# EAGLE schematic main (EAGLE 8.5.0)
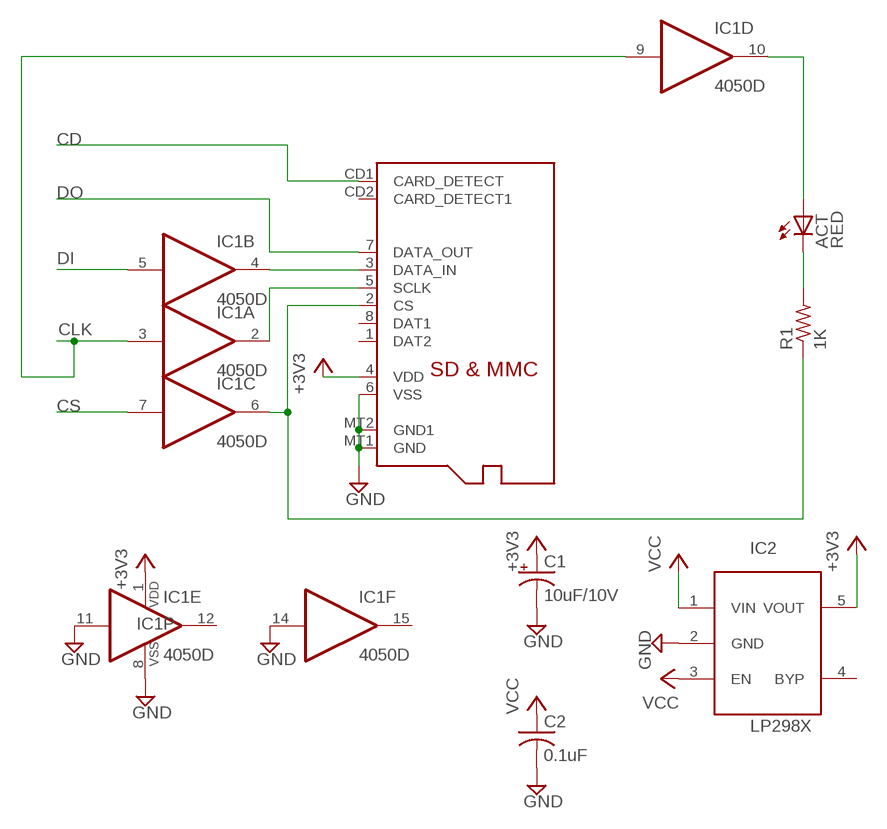
[diagram p0: schematic, sheet 1]

## Parts
ACT  RED  LEDCHIP-LED0805  [CHIP-LED0805]
C1  10uF/10V  CPOL-USA/3216-18R  [A/3216-18R]
C2  0.1uF  C-USC0805K  [C0805K]
IC1  4050D  [SO16]
IC2  LP298XS  [SOT23-5L]
R1  1K  R-US_R0805  [R0805]
X1  MICROSD  [MICROSD]

## Nets
+3V3: C1.+ IC1.1(P:VDD) IC2.5(VOUT) X1.4(VDD)
CD: X1.CD1(CARD_DETECT)
CLK: IC1.3(A:I) IC1.9(D:I)
CS: IC1.7(C:I)
DI: IC1.5(B:I)
DO: X1.7(DATA_OUT)
GND: C1.- C2.2 IC1.8(P:VSS) IC1.11(E:I) IC1.14(F:I) IC2.2(GND) X1.6(VSS) X1.MT1(GND) X1.MT2(GND1)
N$1: ACT.A IC1.10(D:O)
N$2: IC1.2(A:O) X1.5(SCLK)
N$3: IC1.6(C:O) R1.1 X1.2(CS)
N$4: ACT.C R1.2
N$5: IC1.4(B:O) X1.3(DATA_IN)
VCC: C2.1 IC2.1(VIN) IC2.3(EN)
Unconnected: IC1.12(E:O) IC1.15(F:O) IC2.4(BYP) X1.1(DAT2) X1.8(DAT1) X1.CD2(CARD_DETECT1)

## Library data of the parts
ACT = adafruit:LED: LED OSRAM: - CHIPLED LG R971, LG N971, LY N971, LG Q971, LY Q971, LO R971, LY R971 LH N974, LH R974 LS Q976, LO Q976, LY Q976 LO Q996 - Hyper CHIPLED LW Q18S LB Q993, LB Q99A, LB R99A - SideLED LS A670, LO A670, LY A670, LG A670, LP A670 LB A673, LV A673, LT A673, LW A673 LH A674 LY A675 LS A676, LA A676, LO A676, LY A676, LW A676 LS A679, LY A679, LG A679 - Hyper Micro SIDELED® LS Y876, LA Y876, LO Y876, LY Y876 LT Y87S - SmartLED LW L88C, LW L88S LB L89C, LB L89S, LG L890 LS L89K, LO L89K, LY L89K LS L896, LA L896, LO L896, LY L896 - TOPLED LS T670, LO T670, LY T670, LG T670, LP T670 LSG T670, LSP T670, LSY T670, LOP T670, LYG T670 LG T671, LOG T671, LSG T671 LB T673, LV T673, LT T673, LW T673 LH T674 LS T676, LA T676, LO T676, LY T676, LB T676, LH T676, LSB T676, LW T676 LB T67C, LV T67C, LT T67C, LS T67K, LO T67K, LY T67K, LW E67C LS E67B, LA E67B, LO E67B, LY E67B, LB E67C, LV E67C, LT E67C LW T67C LS T679, LY T679, LG T679 LS T770, LO T770, LY T770, LG T770, LP T770 LB T773, LV T773, LT T773, LW T773 LH T774 LS E675, LA E675, LY E675, LS T675 LS T776, LA T776, LO T776, LY T776, LB T776 LHGB T686 LT T68C, LB T68C - Hyper Mini TOPLED® LB M676 - Mini TOPLED Santana® LG M470 LS M47K, LO M47K, LY M47K Source: http://www.osram.convergy.de/
C1 = adafruit:CPOL-US: POLARIZED CAPACITOR, American symbol
C2 = adafruit:C-US: CAPACITOR, American symbol
IC1 = 40xx:4050: Hex non-inverting BUFFER
IC2 = adafruit:LP298X
R1 = adafruit:R-US_: RESISTOR, American symbol
X1 = adafruit:MICROSD: Micro-SD / Transflash card holder with SPI pinout For the 3M # 2908-05WB-MG and/or 4UCON #19656 push-push type